# Altium schematic sheet RF-UNIT-BIG-35W.SCHDOC: RF-UNIT BIG
size A4; DocumentNumber: 12; Revision: 2.0; SheetNumber: 12; SheetTotal: 18
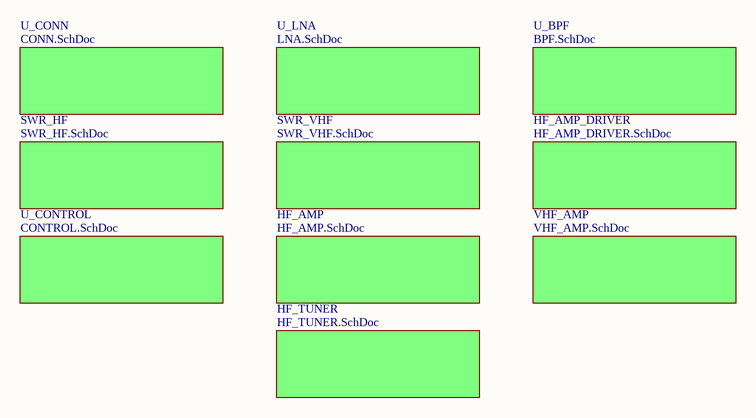
[diagram p0: RF-UNIT-BIG-35W.SCHDOC]

## Sub-sheets
HF_AMP = HF_AMP.SchDoc: no entries
HF_AMP_DRIVER = HF_AMP_DRIVER.SchDoc: no entries
HF_TUNER = HF_TUNER.SchDoc: no entries
SWR_HF = SWR_HF.SchDoc: no entries
SWR_VHF = SWR_VHF.SchDoc: no entries
U_BPF = BPF.SchDoc: no entries
U_CONN = CONN.SchDoc: no entries
U_CONTROL = CONTROL.SchDoc: no entries
U_LNA = LNA.SchDoc: no entries
VHF_AMP = VHF_AMP.SchDoc: no entries

## Notes on the sheet
- Title
- Size:
- Date:
- A4
- Number:
- Time:
- Revision:
- Sheet
- of
- File: